# EAGLE design Motor Driver Arduino Uno Shield (EAGLE 9.6.2)
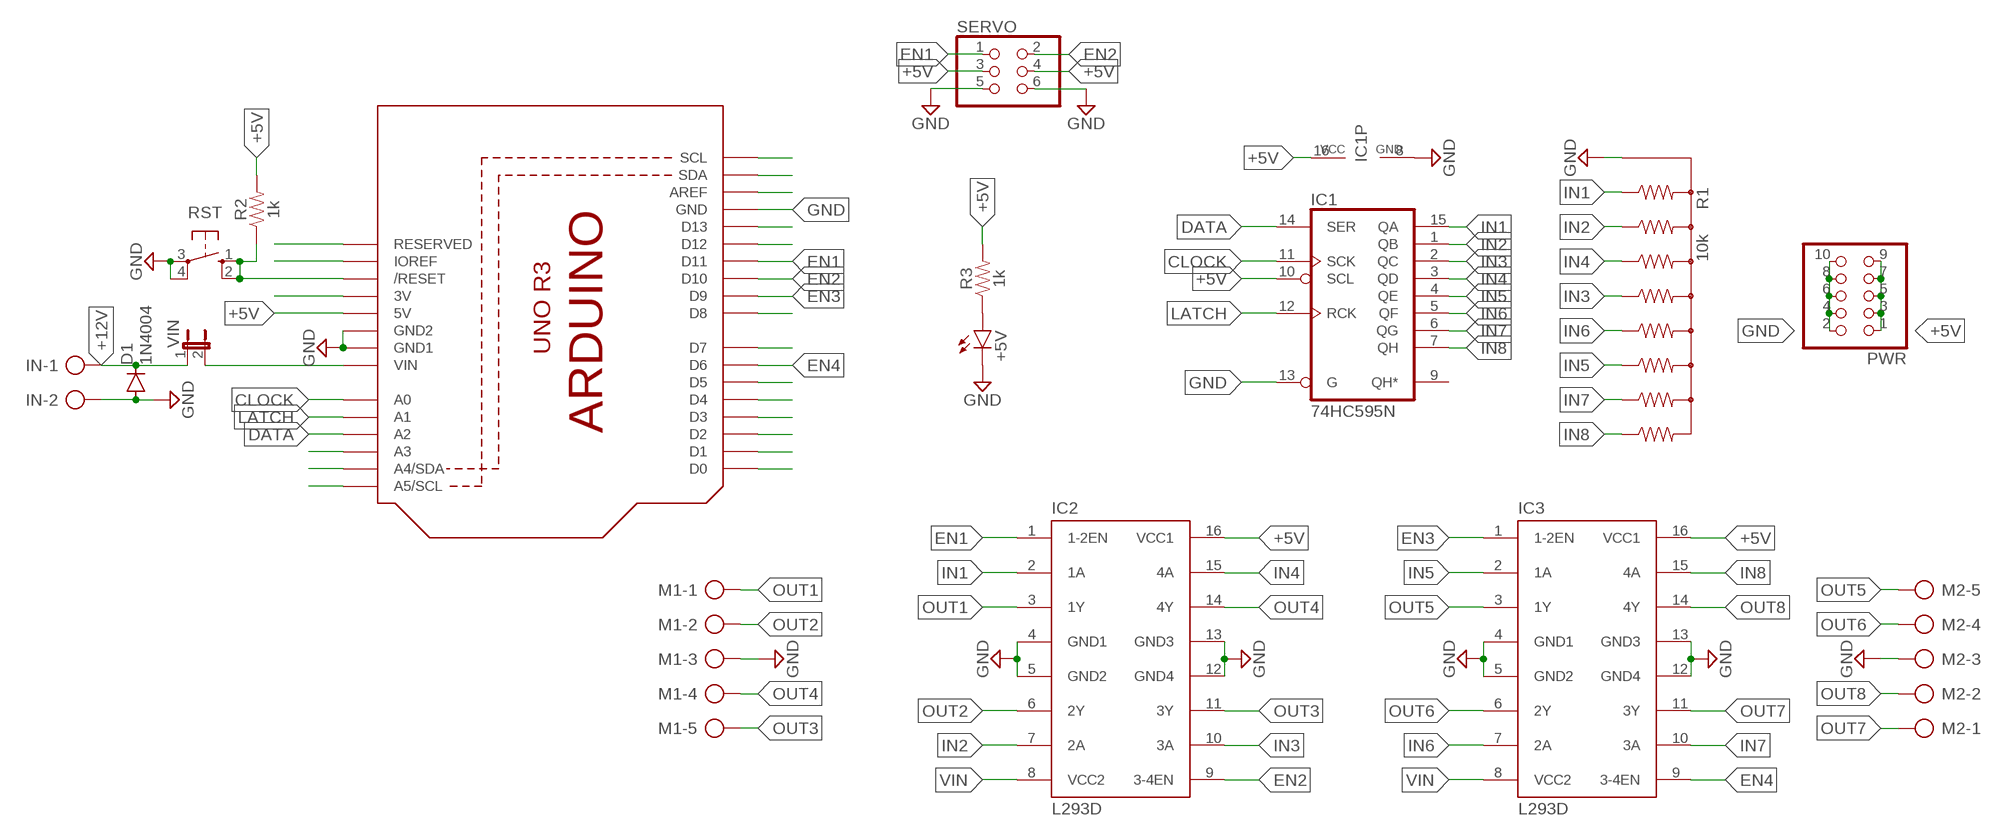
[diagram p0: schematic, sheet 1]

## Parts
+5V  LEDCHIP-LED0805  [CHIP-LED0805]
D1  1N4004  [DO41-10]
IC1  74HC595N  [DIL16]
IC2  L293D  [DIL16]
IC3  L293D  [DIL16]
IN  AK500/2-H  [AK500/2-H]
M1  AK500/5-H  [AK500/5-H]
M2  AK500/5-H  [AK500/5-H]
PWR  PINHD-2X5  [2X05]
R1  10k  4609X-101-103LF  [4609X-101-103LF]
R2  1k  RESISTOR1206  [1206]
R3  1k  RESISTOR1206  [1206]
RST  10-XX  [B3F-10XX]
SERVO  PINHD-2X3  [2X03]
U1  ARDUINOR3-BPLACE  [ARDUINOR3-BPLACE]
VIN  JP1E  [JP1]

## Nets
+5V: IC1.10(SCL) IC1.16(VCC) IC2.16(VCC1) IC3.16(VCC1) PWR.1 PWR.3 PWR.5 PWR.7 PWR.9 R2.2 R3.2 SERVO.3 SERVO.4 U1.5V
+12V: D1.C IN.1 VIN.1
AREF: U1.AREF
CLOCK: IC1.11(SCK) U1.A0
D2: U1.D2
D3: U1.D3
D4: U1.D4
D5: U1.D5
D7: U1.D7
D8: U1.D8
D12: U1.D12
D13: U1.D13
DATA: IC1.14(SER) U1.A2
EN1: IC2.1(1-2EN) SERVO.1 U1.D11
EN2: IC2.9(3-4EN) SERVO.2 U1.D10
EN3: IC3.1(1-2EN) U1.D9
EN4: IC3.9(3-4EN) U1.D6
GND: +5V.C D1.A IC1.8(GND) IC1.13(G) IC2.4(GND1) IC2.5(GND2) IC2.12(GND4) IC2.13(GND3) IC3.4(GND1) IC3.5(GND2) IC3.12(GND4) IC3.13(GND3) IN.2 M1.3 M2.3 PWR.2 PWR.4 PWR.6 PWR.8 PWR.10 R1.1 RST.3(P) RST.4(P1) SERVO.5 SERVO.6 U1.GND U1.GND1 U1.GND2
IN1: IC1.15(QA) IC2.2(1A) R1.2
IN2: IC1.1(QB) IC2.7(2A) R1.3
IN3: IC1.2(QC) IC2.10(3A) R1.5
IN4: IC1.3(QD) IC2.15(4A) R1.4
IN5: IC1.4(QE) IC3.2(1A) R1.7
IN6: IC1.5(QF) IC3.7(2A) R1.6
IN7: IC1.6(QG) IC3.10(3A) R1.8
IN8: IC1.7(QH) IC3.15(4A) R1.9
LATCH: IC1.12(RCK) U1.A1
N$1: +5V.A R3.1
N$2: U1.D1
N$3: U1.D0
N$4: U1.A3
N$5: U1.A4(A4/SDA)
N$6: U1.A5(A5/SCL)
N$7: U1.3V
N$8: U1.IOREF
N$9: U1.RESERVED
OUT1: IC2.3(1Y) M1.1
OUT2: IC2.6(2Y) M1.2
OUT3: IC2.11(3Y) M1.5
OUT4: IC2.14(4Y) M1.4
OUT5: IC3.3(1Y) M2.5
OUT6: IC3.6(2Y) M2.4
OUT7: IC3.11(3Y) M2.1
OUT8: IC3.14(4Y) M2.2
RST: R2.1 RST.1(S) RST.2(S1) U1.RESET(/RESET)
SCL: U1.SCL
SDA: U1.SDA
VIN: IC2.8(VCC2) IC3.8(VCC2) U1.VIN VIN.2
Unconnected: IC1.9(QH*)

## Library data of the parts
+5V = led:LED: LED OSRAM: - CHIPLED LG R971, LG N971, LY N971, LG Q971, LY Q971, LO R971, LY R971 LH N974, LH R974 LS Q976, LO Q976, LY Q976 LO Q996 - Hyper CHIPLED LW Q18S LB Q993, LB Q99A, LB R99A - SideLED LS A670, LO A670, LY A670, LG A670, LP A670 LB A673, LV A673, LT A673, LW A673 LH A674 LY A675 LS A676, LA A676, LO A676, LY A676, LW A676 LS A679, LY A679, LG A679 - Hyper Micro SIDELED® LS Y876, LA Y876, LO Y876, LY Y876 LT Y87S - SmartLED LW L88C, LW L88S LB L89C, LB L89S, LG L890 LS L89K, LO L89K, LY L89K LS L896, LA L896, LO L896, LY L896 - TOPLED LS T670, LO T670, LY T670, LG T670, LP T670 LSG T670, LSP T670, LSY T670, LOP T670, LYG T670 LG T671, LOG T671, LSG T671 LB T673, LV T673, LT T673, LW T673 LH T674 LS T676, LA T676, LO T676, LY T676, LB T676, LH T676, LSB T676, LW T676 LB T67C, LV T67C, LT T67C, LS T67K, LO T67K, LY T67K, LW E67C LS E67B, LA E67B, LO E67B, LY E67B, LB E67C, LV E67C, LT E67C LW T67C LS T679, LY T679, LG T679 LS T770, LO T770, LY T770, LG T770, LP T770 LB T773, LV T773, LT T773, LW T773 LH T774 LS E675, LA E675, LY E675, LS T675 LS T776, LA T776, LO T776, LY T776, LB T776 LHGB T686 LT T68C, LB T68C - Hyper Mini TOPLED® LB M676 - Mini TOPLED Santana® LG M470 LS M47K, LO M47K, LY M47K Source: http://www.osram.convergy.de LUXEON: - LUMILED® LXK2-PW12-R00, LXK2-PW12-S00, LXK2-PW14-U00, LXK2-PW14-V00 LXK2-PM12-R00, LXK2-PM12-S00, LXK2-PM14-U00 LXK2-PE12-Q00, LXK2-PE12-R00, LXK2-PE12-S00, LXK2-PE14-T00, LXK2-PE14-U00 LXK2-PB12-K00, LXK2-PB12-L00, LXK2-PB12-M00, LXK2-PB14-N00, LXK2-PB14-P00, LXK2-PB14-Q00 LXK2-PR12-L00, LXK2-PR12-M00, LXK2-PR14-Q00, LXK2-PR14-R00 LXK2-PD12-Q00, LXK2-PD12-R00, LXK2-PD12-S00 LXK2-PH12-R00, LXK2-PH12-S00 LXK2-PL12-P00, LXK2-PL12-Q00, LXK2-PL12-R00 Source: www.luxeon.com KINGBRIGHT: KA-3528ASYC Source: www.kingbright.com
D1 = diode:1N4004: DIODE general purpose rectifier, 1 A
IC1 = 74xx-eu:74*595: 8-bit SHIFT REGISTER, output latch
IC2 IC3 = st-microelectronics:L293D: PUSH-PULL 4 CHANNEL DRIVER; MPN: L293D; OC_FARNELL: 9589619; OC_NEWARK: 56P8249
IN = con-ptr500:AK500/2-H: CONNECTOR Aug. 2004 / PTR Meßtechnik: Die Bezeichnung der Serie AK505 wurde geändert. Es handelt sich hierbei um AK500 in horizontaler Ausführung.; OC_FARNELL: unknown; OC_NEWARK: unknown
M1 M2 = con-ptr500:AK500/5-H: CONNECTOR Aug. 2004 / PTR Meßtechnik: Die Bezeichnung der Serie AK505 wurde geändert. Es handelt sich hierbei um AK500 in horizontaler Ausführung.; OC_FARNELL: unknown; OC_NEWARK: unknown
PWR = pinhead:PINHD-2X5: PIN HEADER
R1 = Resistor Array:4609X-101-103LF: RES ARRAY 8 RES 10K OHM 9SIP Manufacturer's datasheet <https://www.bourns.com/docs/Product-Datasheets/4600x.pdf>; CREATED_BY: PCBLayout.com; DIGIKEY_PN: 4609X-101-103LF-ND; MANUFACTURER: Bourns Inc.; MPN: 4609X-101-103LF; PACKAGE: SIP-9
R2 R3 = SparkFun-Resistors:RESISTOR: Generic Resistor Package
RST = switch-omron:10-XX: OMRON SWITCH; MPN: B3F-1000; OC_FARNELL: 176432; OC_NEWARK: 36M3542
SERVO = pinhead:PINHD-2X3: PIN HEADER
U1 = adafruit:ARDUINOR3: This is a new object for the new Arduino R3 - with extra pins that you may want to use (such as IOref, and duplicated A4/A5
VIN = jumper:JP1E: JUMPER

## Board
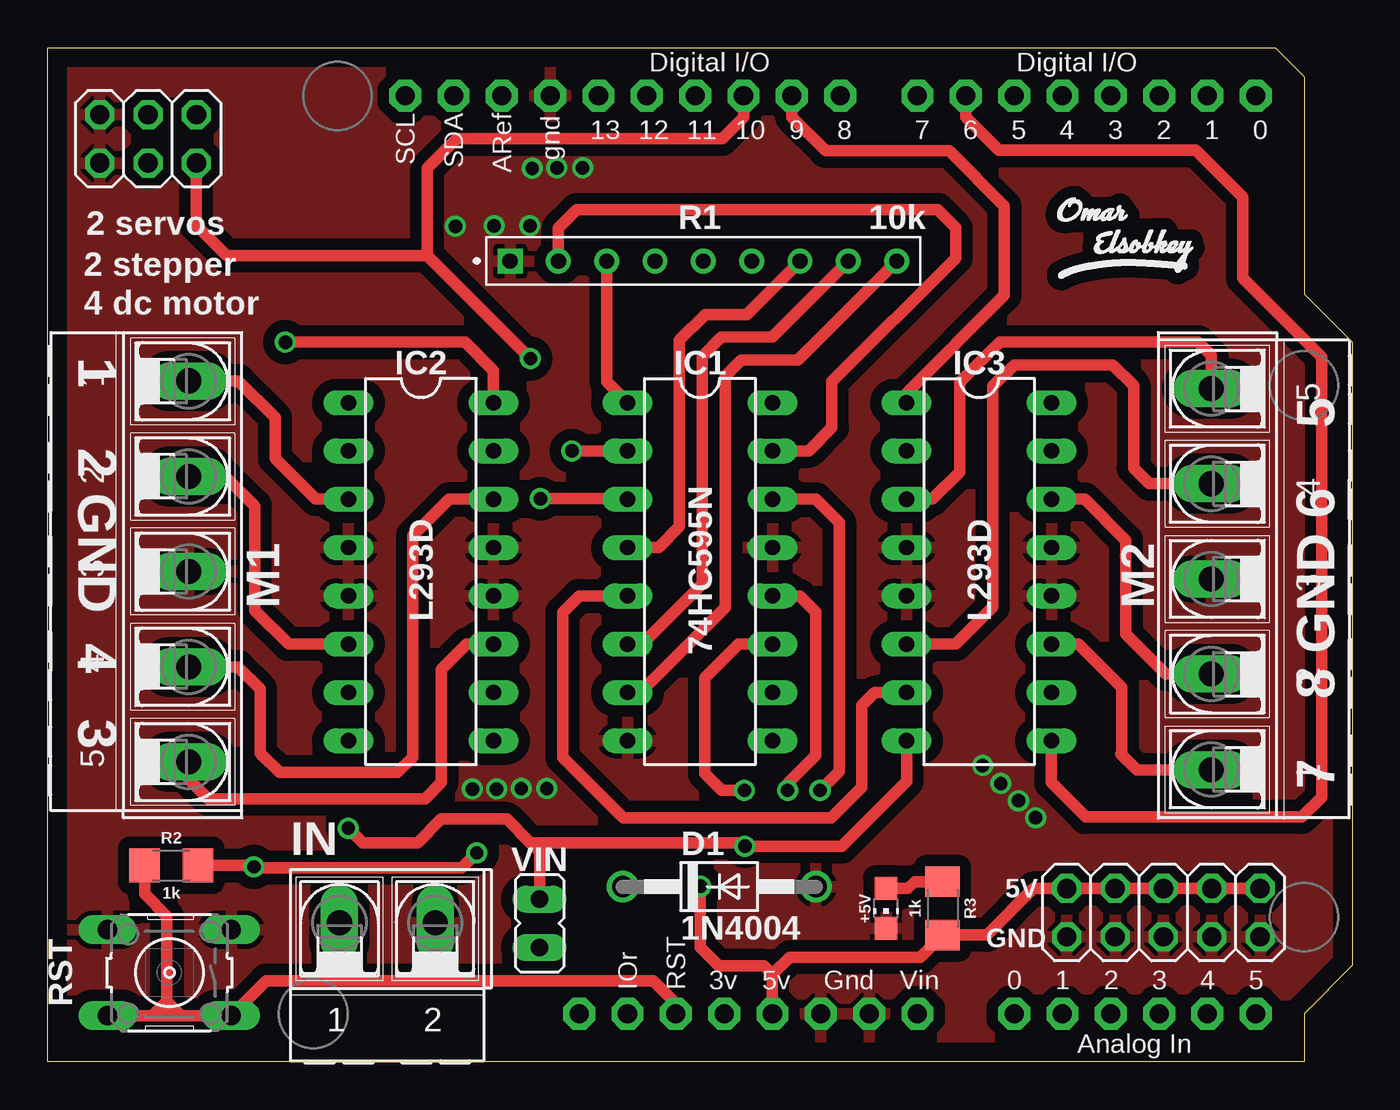
[diagram p1: board, top side]
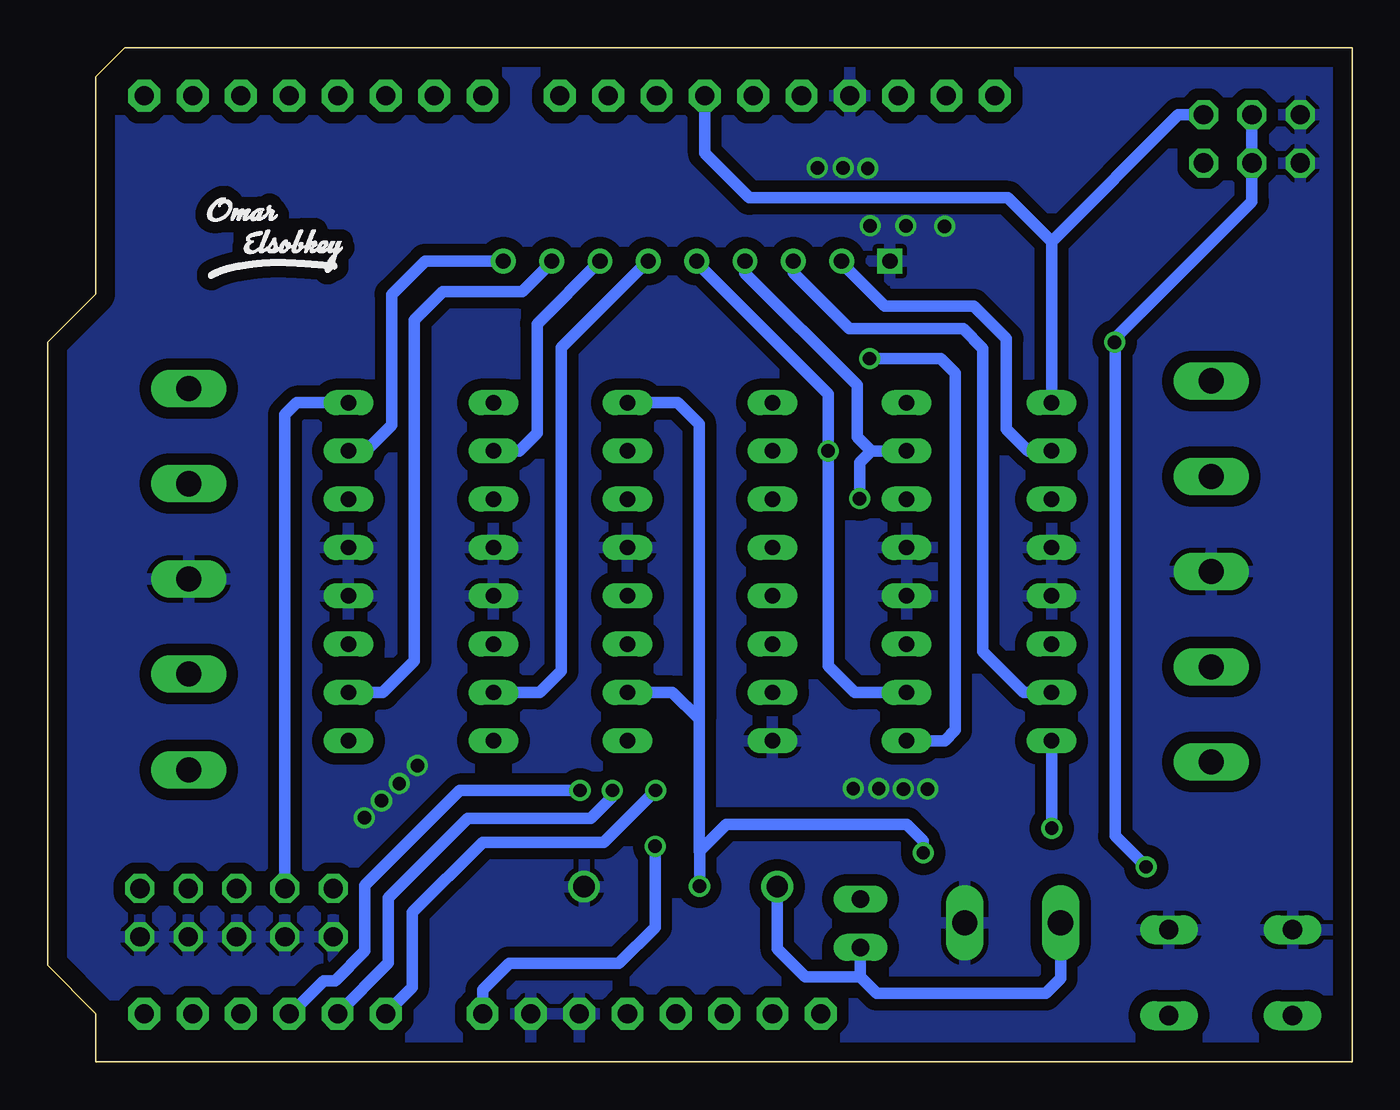
[diagram p2: board, bottom side, seen from below]

Size 68.58 x 53.34 mm. Coordinates in mm from the lower left corner, seen from the top.
Outline: 0,53.34 0.03,53.34
Outline: 0.03,53.34 64.52,53.34 66.04,51.82 66.04,40.39 68.58,37.85 68.58,5.08 66.04,2.54 66.04,0 0,0 0,53.31 0.03,53.34
Copper layers (1*16): Top 0.035mm / dielectric 1.5mm / Bottom 0.035mm
Design rules "default *": minimum track width 0.6mm, minimum drill 0.7mm, track to track 0.6mm, track to pad 0.6mm, pad to pad 0.6mm, via to via 0.6mm, smd to smd 0.6mm, copper to edge 40mil, drill to drill 6mil, minimum pad ring 10mil, minimum via ring 8mil, stop-mask expansion 4mil, vias tented up to drill 0mil, thermal gap 10mil

### Footprints (pad centres in the part's own frame; a part is rotated, then mirrored left to right if it is on the bottom)
CHIP-LED0805 = smd 1.2 x 1.2: A 0,-1.05; C 0,1.05
DO41-10 = drill 1.118: A 5.08,0; C -5.08,0
DIL16 = drill 0.813 long: 1 -8.89,-3.81; 2 -6.35,-3.81; 3 -3.81,-3.81; 4 -1.27,-3.81; 5 1.27,-3.81; 6 3.81,-3.81; 7 6.35,-3.81; 8 8.89,-3.81; 9 8.89,3.81; 10 6.35,3.81; 11 3.81,3.81; 12 1.27,3.81; 13 -1.27,3.81; 14 -3.81,3.81; 15 -6.35,3.81; 16 -8.89,3.81
AK500/2-H = drill 1.321 long: 1 -2.515,0; 2 2.515,0
AK500/5-H = drill 1.321 long: 1 -10.033,0; 2 -5.004,0; 3 0,0; 4 5.004,0; 5 10.008,0
2X05 = drill 1.016 octagon: 1 -5.08,-1.27; 2 -5.08,1.27; 3 -2.54,-1.27; 4 -2.54,1.27; 5 0,-1.27; 6 0,1.27; 7 2.54,-1.27; 8 2.54,1.27; 9 5.08,-1.27; 10 5.08,1.27
4609X-101-103LF = drill 0.8 square: 1 0,0 | drill 0.8: 2 2.54,0; 3 5.08,0; 4 7.62,0; 5 10.16,0; 6 12.7,0; 7 15.24,0; 8 17.78,0; 9 20.32,0
1206 = smd 1.6 x 1.8: 1 -1.4,0; 2 1.4,0
B3F-10XX = drill 1.016 long: 1 -3.251,2.261; 2 3.251,2.261; 3 -3.251,-2.261; 4 3.251,-2.261
2X03 = drill 1.016 octagon: 1 -2.54,-1.27; 2 -2.54,1.27; 3 0,-1.27; 4 0,1.27; 5 2.54,-1.27; 6 2.54,1.27
ARDUINOR3-BPLACE = drill 1 pad 1.676 octagon: 3V 35.56,2.54; 5V 38.1,2.54; A0 50.8,2.54; A1 53.34,2.54; A2 55.88,2.54; A3 58.42,2.54; A4 60.96,2.54; A5 63.5,2.54; AREF 23.876,50.8; D0 63.5,50.8; D1 60.96,50.8; D2 58.42,50.8; D3 55.88,50.8; D4 53.34,50.8; D5 50.8,50.8; D6 48.26,50.8; D7 45.72,50.8; D8 41.656,50.8; D9 39.116,50.8; D10 36.576,50.8; D11 34.036,50.8; D12 31.496,50.8; D13 28.956,50.8; GND 26.416,50.8; GND1 43.18,2.54; GND2 40.64,2.54; IOREF 30.48,2.54; RESERVED 27.94,2.54; RESET 33.02,2.54; SCL 18.796,50.8; SDA 21.336,50.8; VIN 45.72,2.54
JP1 = drill 0.914 long: 1 0,-1.27; 2 0,1.27

### Placement (x,y rotation side)
+5V  44.07,8.08 180 top
D1  35.31,9.22 0 top
IC1  34.29,25.78 270 top
IC2  19.62,25.78 270 top
IC3  48.96,25.78 270 top
IN  17.86,7.32 0 top
M1  7.42,25.78 270 top
M2  61.16,25.4 90 top
PWR  58.65,7.85 180 top
R1  24.31,42.11 0 top
R2  6.5,10.34 0 top
R3  47.04,8.08 270 top
RST  6.4,4.7 180 top
SERVO  5.28,48.54 180 top
U1  0,0 0 top
U$1  [OMAR_ELSOBKEY_X0.5_TN]  56.29,43.13 0 top
U$2  [OMAR_ELSOBKEY_X0.5_T]  56.29,43.13 0 top
U$3  [OMAR_ELSOBKEY_X0.5_TN]  56.97,43.13 0 bottom
U$4  [OMAR_ELSOBKEY_X0.5_T]  56.97,43.13 0 bottom
VIN  25.86,7.29 0 top

### Tracks (layer width: path | path; a pad name or v marks a point on that pad's centre or on a via)
+5V  (via drill 0.7)
  Top 0.6: R2.2 10.77,10.34 v10.85,10.26 10.9,10.21 21.77,10.21 v22.55,10.99 | v12.5,37.85 21.95,37.85 23.43,36.36 IC2.16 | PWR.1 PWR.3 PWR.5 PWR.7 PWR.9 51.82,9.12 49.38,6.68 R3.2 45.88,5.51 39.01,5.51 38.1,4.6 | U1.5V 38.1,4.6 | 38.1,4.6 37.64,5.05 35.28,5.05 34.31,6.02 v34.31,9.25
  Bottom 0.6: v10.85,10.26 12.47,11.89 12.47,37.82 v12.5,37.85 12.5,38.02 5.28,45.24 SERVO.4 SERVO.3 | IC1.16 35.46,34.67 34.34,33.55 34.34,18.03 | IC1.10 35.74,19.43 34.34,18.03 | IC3.16 55.47,34.67 56.11,34.04 PWR.7 | 34.34,11.07 34.34,18.03 | v22.55,10.99 22.55,11.63 23.42,12.5 32.92,12.5 34.34,11.07 | v34.31,9.25 34.31,11.05 34.34,11.07
+12V
  Bottom 0.6: VIN.1 25.86,4.47 | 25.86,4.47 24.99,3.61 16.13,3.61 15.34,4.39 IN.1 | 25.86,4.47 28.75,4.47 30.23,5.94 D1.C
CLOCK  (via drill 0.7)
  Top 0.6: IC1.11 36.32,21.97 34.54,20.19 34.54,15.16 35.43,14.28 v36.63,14.28
  Bottom 0.6: v36.63,14.28 39.35,11.56 45.72,11.56 49.42,7.86 49.42,3.92 U1.A0
DATA  (via drill 0.7)
  Top 0.6: v40.6,14.28 41.6,15.28 41.6,28.37 40.38,29.59 IC1.14
  Bottom 0.6: v40.6,14.28 46.91,14.28 51.91,9.28 51.91,5.84 53.47,4.28 54.06,4.28 55.8,2.54 U1.A2
EN1
  Bottom 0.6: IC2.1 15.81,43.14 | U1.D11 34.04,47.78 31.7,45.44 18.11,45.44 15.81,43.14 | 15.81,43.14 9.14,49.81 SERVO.1
EN2  (via drill 0.7)
  Top 0.6: v25.38,36.98 19.96,42.39 | U1.D10 36.6,50.77 36.6,49.68 35.46,48.54 21.51,48.54 19.96,46.99 19.96,42.39 | 19.96,42.39 9.42,42.39 7.82,43.99 SERVO.2
  Bottom 0.6: IC2.9 21.44,16.89 20.88,17.45 20.88,36.22 21.64,36.98 v25.38,36.98
EN3
  Top 0.6: U1.D9 39.12,49.68 40.89,47.9 47.4,47.9 50.29,45.01 50.29,40.31 45.15,35.17 IC3.1
EN4
  Top 0.6: U1.D6 48.26,49.68 49.99,47.95 60.35,47.95 62.82,45.48 62.82,41.21 66.95,37.08 66.95,13.92 65.91,12.88 54.56,12.88 52.74,14.69 52.74,16.87 IC3.9
GND  (via drill 0.7)
  Top 0.6: IC1.13 37.12,27.05 37.04,27.13
  other vias: 24.89,14.38 26.24,14.38 23.6,14.35 22.33,14.35 26.77,47.02 28.12,47.02 25.48,46.99 23.47,43.97 25.35,43.97 21.44,43.94 50.1,14.64 49.14,15.59 51.03,13.74 51.93,12.84
  pour Top (isolate 0.6): -2.16,55.07 71.58,55.07 71.58,-2.21 -2.16,-2.21
  pour Bottom (isolate 0.6): -4.34,56.62 -4.34,-3.94 75.18,-3.94 75.18,56.62
IN1
  Top 0.6: R1.2 26.85,43.84 27.81,44.81 46.79,44.81 47.73,43.87 47.73,42.27 41.22,35.76 41.22,33.35 40,32.13 IC1.15
  Bottom 0.6: IC2.2 17.04,32.13 18.19,33.27 18.19,38.02 19.91,39.75 24.59,39.75 26.85,42.01 R1.2
IN2
  Top 0.6: IC1.1 29.39,35.76 R1.3
  Bottom 0.6: IC2.7 17.27,19.43 19.43,21.59 19.43,37.52 20.47,38.55 26.44,38.55 29.39,41.5 R1.3
IN3  (via drill 0.7)
  Top 0.6: IC1.2 v27.56,32.13
  Bottom 0.6: IC2.10 26.16,19.43 27.56,20.83 v27.56,32.13 27.56,35.13 34.47,42.04 R1.5
IN4  (via drill 0.7)
  Top 0.6: v25.91,29.62 30.45,29.62 IC1.3
  Bottom 0.6: IC2.15 25.3,32.13 | R1.4 31.93,41.48 26.04,35.58 26.04,32.87 25.3,32.13 | 25.3,32.13 25.91,31.52 v25.91,29.62
IN5
  Top 0.6: R1.7 36.74,39.31 34.57,39.31 33.21,37.95 33.21,28.14 32.12,27.05 IC1.4
  Bottom 0.6: IC3.2 43.79,32.13 42.85,33.07 42.85,38.81 R1.7
IN6
  Top 0.6: IC3.7 43.48,19.43 42.8,18.75 42.8,14.43 41.2,12.83 30.25,12.83 27.08,16 27.08,23.65 27.94,24.51 IC1.5
  Bottom 0.6: IC3.7 42.72,19.43 41.58,20.57 41.58,37.57 37.03,42.11 R1.6
IN7
  Top 0.6: R1.8 38.08,38.11 35.42,38.11 34.41,37.1 34.41,25.12 31.26,21.97 IC1.6
  Bottom 0.6: IC3.10 50.95,19.43 49.3,21.09 49.3,39.02 47.82,40.49 43.64,40.49 42.09,42.05 R1.8
IN8
  Top 0.6: R1.9 39.42,36.91 36.45,36.91 35.61,36.07 35.61,23.9 31.14,19.43 IC1.7
  Bottom 0.6: R1.9 48.74,42.11 50.5,40.36 50.5,33.5 51.87,32.13 IC3.15
LATCH  (via drill 0.7)
  Top 0.6: v38.89,14.28 38.89,14.64 40.37,16.12 40.37,23.66 39.52,24.51 IC1.12
  Bottom 0.6: v38.89,14.28 38.89,13.95 38.89,13.93 40.02,12.8 46.51,12.8 50.67,8.64 50.67,5.21 U1.A1
N$1
  Top 0.6: +5V.A 45.22,9.13 45.57,9.48 R3.1
OUT1
  Top 0.6: IC2.3 14.1,29.59 11.96,31.72 11.96,33.88 10.03,35.81 M1.1
OUT2
  Top 0.6: IC2.6 12.67,21.97 10.9,23.75 10.9,29.23 9.35,30.79 M1.2
OUT3
  Top 0.6: IC2.11 22.02,21.97 20.7,20.65 20.7,14.71 19.84,13.84 8.43,13.84 7.42,14.86 M1.5
OUT4
  Top 0.6: IC2.14 21.11,29.59 19.2,27.69 19.2,16.03 18.39,15.21 12.19,15.21 11.18,16.23 11.18,19.61 10.01,20.78 M1.4
OUT5
  Top 0.6: M2.5 61.16,37.16 60.48,37.85 50.04,37.85 47.93,35.74 47.93,31.01 46.51,29.59 IC3.3
OUT6
  Top 0.6: IC3.6 47.73,21.97 49.68,23.93 49.68,35.53 50.79,36.65 55.99,36.65 57.07,35.56 57.07,31.24 57.91,30.4 M2.4
OUT7
  Top 0.6: IC3.11 54.18,21.97 56.46,19.68 56.46,16.26 56.41,16.21 57.25,15.37 M2.1
OUT8
  Top 0.6: IC3.14 54.51,29.59 56.67,27.43 56.67,22.5 58.78,20.4 M2.2
RST
  Top 0.6: U1.RESET 33.02,3.1 31.84,4.28 11.49,4.28 RST.1 7.04,2.44 | 7.04,2.44 6.27,2.44 | 6.27,2.44 5.51,2.44 | 5.51,2.44 RST.2 | R2.1 5.1,8.84 6.27,7.67 6.27,3.2 | 6.27,3.2 6.27,2.44 | 5.51,2.44 6.27,3.2 | 6.27,3.2 7.04,2.44
VIN  (via drill 0.7)
  Top 0.6: 26.82,8.56 VIN.2 25.86,11.05 | v15.8,12.29 16.56,11.53 19.46,11.53 20.7,12.78 24.13,12.78 25.38,11.53 | IC3.8 45.15,14.75 41.73,11.33 36.67,11.33 v36.65,11.35 36.47,11.53 26.34,11.53 | 26.34,11.53 25.81,11.53 | 25.81,11.53 25.38,11.53 | 25.81,11.53 25.86,11.48 25.86,11.05 | 26.34,11.53 25.86,11.05 | 25.86,11.05 25.38,11.53
  Bottom 0.6: IC2.8 15.81,12.31 v15.8,12.29 | U1.VIN 45.72,3.78 44.32,5.18 38.56,5.18 36.65,7.09 v36.65,11.35

### Text on the board
tNames: 2 servos | 2 stepper | 4 dc motor | 1 2 GND 4 3 | 7 8 GND 6 5 | 5V | GND